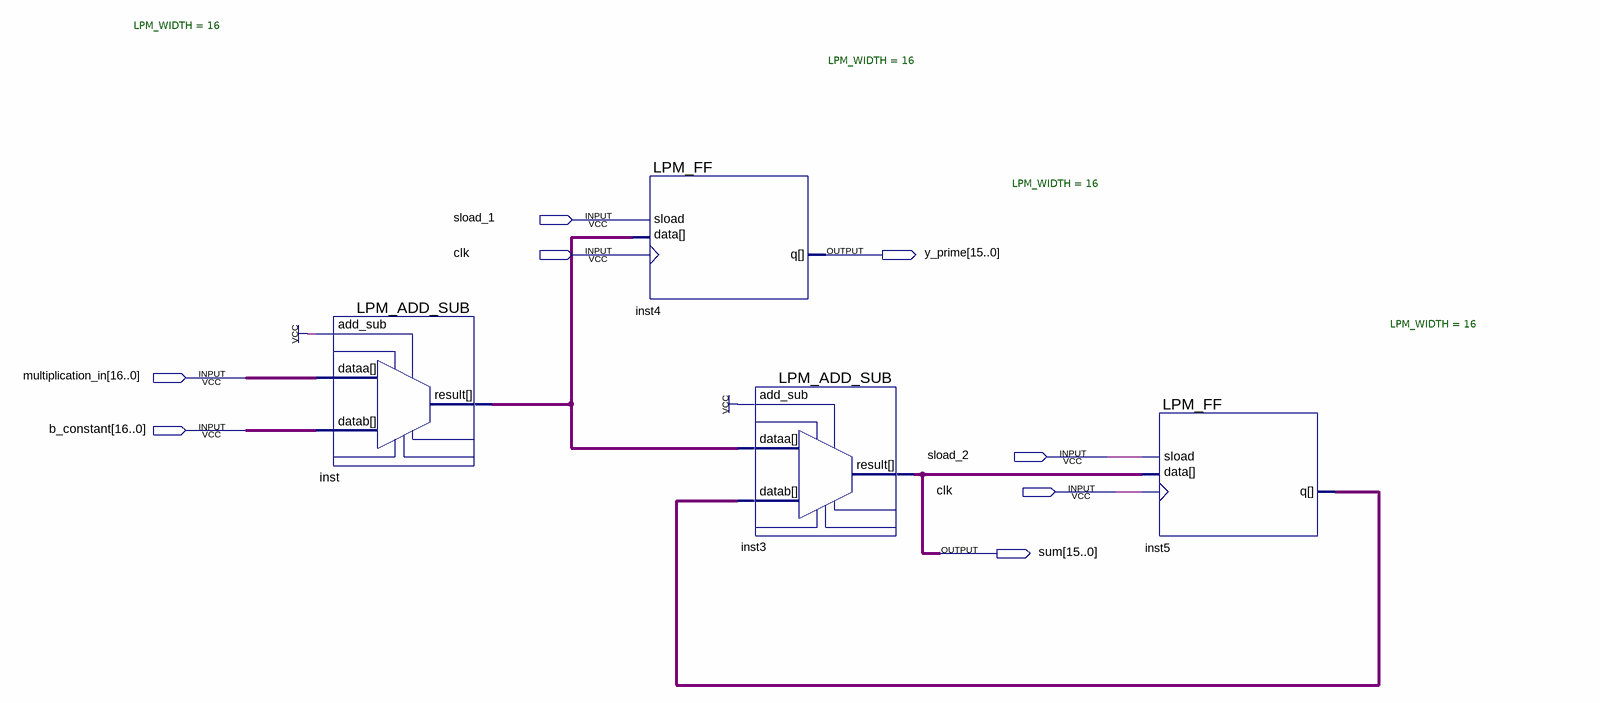
[diagram p0: schematic sheet]
// Quartus schematic RND_FINAL_Y_AND_FINAL_SUM_CALCULATOR.bdf as structural Verilog: 4 symbols, 8 pins
module RND_FINAL_Y_AND_FINAL_SUM_CALCULATOR (
  input  sload_1,
  input  clk,
  input  [16:0] multiplication_in,
  input  [16:0] b_constant,
  input  sload_2,
  output [15:0] y_prime,
  output [15:0] sum
);

  wire [15:0] inst5_q, inst_result;

  LPM_ADD_SUB #(.LPM_WIDTH(16)) inst (
    .add_sub(1'b1), .dataa(multiplication_in), .datab(b_constant), .result(inst_result));
  LPM_FF #(.LPM_WIDTH(16)) inst4 (.clock(clk), .data(inst_result), .sload(sload_1), .q(y_prime));
  LPM_ADD_SUB #(.LPM_WIDTH(16)) inst3 (.add_sub(1'b1), .dataa(inst_result), .datab(inst5_q), .result(sum));
  LPM_FF #(.LPM_WIDTH(16)) inst5 (.clock(clk), .data(sum), .sload(sload_2), .q(inst5_q));
endmodule
